# Altium project DI.PrjPcb
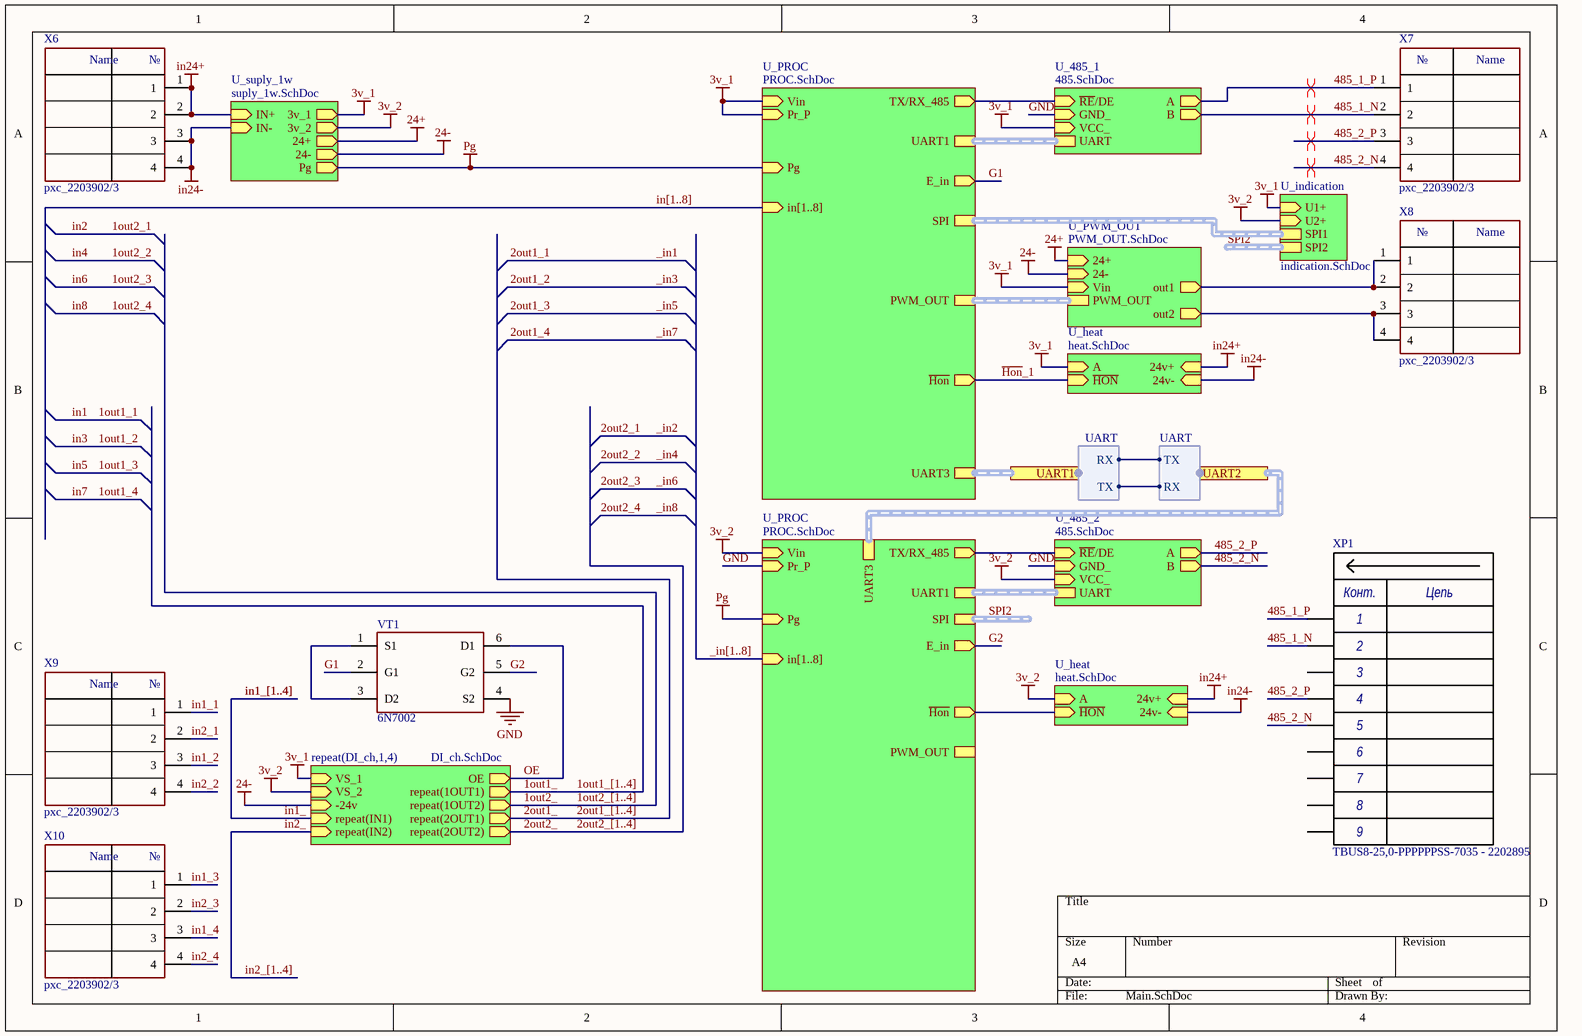
[diagram p0: Main.SchDoc]
8 sheets, 306 parts. Net scope: hierarchical (ports join the sheet entries above them; power ports are global).
Board file: ЕРКФ.758725.093Д11_МОСК.PcbDoc
Sheets:
  Main.SchDoc
    DI_ch1 = DI_ch.SchDoc
    DI_ch2 = DI_ch.SchDoc
    DI_ch3 = DI_ch.SchDoc
    DI_ch4 = DI_ch.SchDoc
    U_suply_1w = suply_1w.SchDoc
    U_485_1 = 485.SchDoc
    U_PROC = PROC.SchDoc
    U_485_2 = 485.SchDoc
    U_PROC = PROC.SchDoc
    U_PWM_OUT = PWM_OUT.SchDoc
    U_indication = indication.SchDoc
    U_heat = heat.SchDoc
    U_heat = heat.SchDoc

## Sheet Main.SchDoc
size A4

### Parts
VT1  6N7002  [sot-23-6]
X6  pxc_2203902/3  [pxc_2203902]
X7  pxc_2203902/3  [pxc_2203902]
X8  pxc_2203902/3  [pxc_2203903]
X9  pxc_2203902/3  [pxc_2203903]
X10  pxc_2203902/3  [pxc_2203903]
XP1  TBUS8-25,0-PPPPPPSS-7035 - 2202895  [TBUS8-25,0-PPPPPPSS-7035 - 2202895]

### Sub-sheets
repeat(DI_ch,1,4) = DI_ch.SchDoc: VS_1 (in), OE (out), -24v (in), repeat(IN1) (in), repeat(IN2) (in), VS_2 (in), repeat(1OUT1) (out), repeat(1OUT2) (out), repeat(2OUT1) (out), repeat(2OUT2) (out)
U_485_1 = 485.SchDoc: ~{RE}/DE (in), GND_ (in), VCC_ (in), A (out), B (out), UART (harness UART)
U_485_2 = 485.SchDoc: ~{RE}/DE (in), GND_ (in), VCC_ (in), A (out), B (out), UART (harness UART)
U_heat = heat.SchDoc: A (in), ~{HON} (in), 24v+ (in), 24v- (in)
U_heat = heat.SchDoc: A (in), ~{HON} (in), 24v+ (in), 24v- (in)
U_indication = indication.SchDoc: U1+ (in), U2+ (in), SPI1 (harness SPI), SPI2 (harness SPI)
U_PROC = PROC.SchDoc: Vin (in), UART1 (harness UART), TX/RX_485 (out), SPI (harness SPI), UART3 (harness UART), PWM_OUT (harness PWM_OUT), Pr_P (in), in[1..8] (in), ~{Hon} (out), Pg (in), E_in (out)
U_PROC = PROC.SchDoc: Vin (in), UART1 (harness UART), TX/RX_485 (out), SPI (harness SPI), UART3 (harness UART), PWM_OUT (harness PWM_OUT), Pr_P (in), in[1..8] (in), ~{Hon} (out), Pg (in), E_in (out)
U_PWM_OUT = PWM_OUT.SchDoc: out2 (out), 24+ (in), 24- (in), out1 (out), Vin (in), PWM_OUT (harness PWM_OUT)
U_suply_1w = suply_1w.SchDoc: IN+ (in), IN- (in), 3v_1 (out), 3v_2 (out), 24+ (out), 24- (out), Pg (out)

### Ports
UART1 (harness UART), UART2 (harness UART)

### Harnesses
UART: RX, TX

### Nets
3v_1: sheet repeat(DI_ch,1,4)/VS_1, sheet U_suply_1w/3v_1, sheet U_485_1/VCC_, sheet U_PROC/Vin, sheet U_PROC/Pr_P, sheet U_PWM_OUT/Vin, sheet U_indication/U1+, sheet U_heat/A
3v_2: sheet repeat(DI_ch,1,4)/VS_2, sheet U_suply_1w/3v_2, sheet U_485_2/VCC_, sheet U_PROC/Vin, sheet U_indication/U2+, sheet U_heat/A
24+: sheet U_suply_1w/24+, sheet U_PWM_OUT/24+
24-: sheet repeat(DI_ch,1,4)/-24v, sheet U_suply_1w/24-, sheet U_PWM_OUT/24-
GND: VT1.4(S2) ; sheet U_485_1/GND_, sheet U_485_2/GND_, sheet U_PROC/Pr_P
in24+: X6.1 X6.2 ; sheet U_suply_1w/IN+, sheet U_heat/24v+, sheet U_heat/24v+
in24-: X6.3 X6.4 ; sheet U_suply_1w/IN-, sheet U_heat/24v-, sheet U_heat/24v-
Pg: sheet U_suply_1w/Pg, sheet U_PROC/Pg, sheet U_PROC/Pg
1out1_: sheet repeat(DI_ch,1,4)/repeat(1OUT1)
1out2_: sheet repeat(DI_ch,1,4)/repeat(1OUT2)
2out1_: sheet repeat(DI_ch,1,4)/repeat(2OUT1)
2out2_: sheet repeat(DI_ch,1,4)/repeat(2OUT2)
485_1_N: X7.2 XP1.2(2c) ; sheet U_485_1/B
485_1_P: X7.1 XP1.1(1c) ; sheet U_485_1/A
485_2_N: X7.4 XP1.5(5c) ; sheet U_485_2/B
485_2_P: X7.3 XP1.4(4c) ; sheet U_485_2/A
G1: VT1.2(G1) ; sheet U_PROC/E_in
G2: VT1.5(G2) ; sheet U_PROC/E_in
~{Hon}_1: sheet U_PROC/~{Hon}, sheet U_heat/~{HON}
in1_: sheet repeat(DI_ch,1,4)/repeat(IN1)
in1_1: X9.1
in1_2: X9.3
in1_3: X10.1
in1_4: X10.3
in2_: sheet repeat(DI_ch,1,4)/repeat(IN2)
in2_1: X9.2
in2_2: X9.4
in2_3: X10.2
in2_4: X10.4
OE: VT1.6(D1) ; sheet repeat(DI_ch,1,4)/OE
NetC43_U_485_1_1: sheet U_485_1/~{RE}/DE, sheet U_PROC/TX/RX_485
NetC43_U_485_2_1: sheet U_485_2/~{RE}/DE, sheet U_PROC/TX/RX_485
NetDD1_U_PROC#1_39: port UART2.RX, port UART1.TX
NetDD1_U_PROC#1_40: port UART2.TX, port UART1.RX
NetDD1_U_PROC#2_14: sheet U_PROC/~{Hon}, sheet U_heat/~{HON}
NetFU2_2: X8.1 X8.2 ; sheet U_PWM_OUT/out1
NetFU3_2: X8.3 X8.4 ; sheet U_PWM_OUT/out2
NetVT1_1: VT1.1(S1) VT1.3(D2)

Not connected (* = marked no-connect by the designer): XP1 3(3c) 6(6c) 7(7e) 8(8e) 9

### Buses and harness runs
bus 1out1_[1..4]
bus 1out2_[1..4]
bus 2out1_[1..4]
bus 2out2_[1..4]
bus _in[1..8] = sheet U_PROC/in[1..8]
bus in1_[1..4]
bus in2_[1..4]
bus in[1..8] = sheet U_PROC/in[1..8]
harness port UART1 = sheet U_PROC/UART3
harness port UART2 = sheet U_PROC/UART3
harness sheet U_485_1/UART = sheet U_PROC/UART1
harness sheet U_485_2/UART = sheet U_PROC/UART1
harness sheet U_indication/SPI1 = sheet U_PROC/SPI
harness sheet U_PROC/PWM_OUT = sheet U_PWM_OUT/PWM_OUT
harness SPI2 = sheet U_indication/SPI2
harness SPI2 = sheet U_PROC/SPI

### Layout directives
differential pair: 485_1_N, 485_1_P, 485_2_N, 485_2_P

### Notes on the sheet
- (in symbol pxc_2203902/3) Name; №
- (in symbol TBUS8-25,0-PPPPPPSS-7035 - 2202895) Конт.; Цепь

### Library data of the parts
XP1 = TBUS8-25,0-PPPPPPSS-7035 - 2202895: Type: TBUS8-25,0-PPPPPPSS-7035 - 2202895

## Sheet DI_ch.SchDoc
size A4
Used 4 times, as channels DI_ch1, DI_ch2, DI_ch3, DI_ch4. Parts and nets are listed once, with the designators drawn on the sheet.
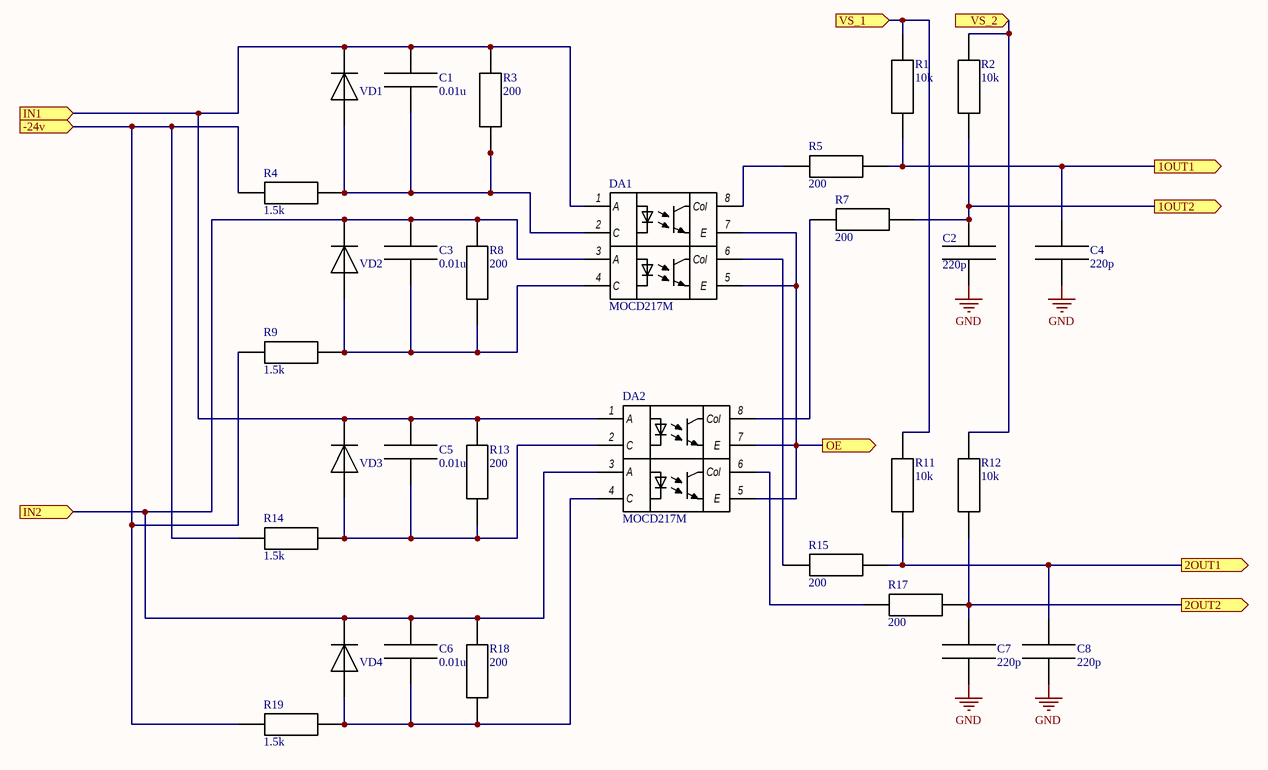
[diagram p1: DI_ch.SchDoc]

### Parts
C1  0.01u  [0603_cap]
C2  220p  [cap_0402]
C3  0.01u  [0603_cap]
C4  220p  [cap_0402]
C5  0.01u  [0603_cap]
C6  0.01u  [0603_cap]
C7  220p  [cap_0402]
C8  220p  [cap_0402]
DA1  MOCD217M  [SO-8_optocup]
DA2  MOCD217M  [SO-8_optocup]
R1  10k  [res_0402]
R2  10k  [res_0402]
R3  200  [0603_res]
R4  1.5k  [2512_res]
R5  200  [res_0402]
R7  200  [res_0402]
R8  200  [0603_res]
R9  1.5k  [2512_res]
R11  10k  [res_0402]
R12  10k  [res_0402]
R13  200  [0603_res]
R14  1.5k  [2512_res]
R15  200  [res_0402]
R17  200  [res_0402]
R18  200  [0603_res]
R19  1.5k  [2512_res]
VD1  1N4448  [sod-323]  (value not drawn)
VD2  1N4448  [sod-323]  (value not drawn)
VD3  1N4448  [sod-323]  (value not drawn)
VD4  1N4448  [sod-323]  (value not drawn)

### Ports
1OUT1 (out), 1OUT2 (out), 2OUT1 (out), 2OUT2 (out), -24v (in), IN1 (in), IN2 (in), OE (out), VS_1 (in), VS_2 (in)

### Nets
GND: C2.1 C4.1 C7.1 C8.1
1OUT1: C4.2 R1.1 R5.1 ; port 1OUT1
1OUT2: C2.2 R2.1 R7.1 ; port 1OUT2
2OUT1: C8.2 R11.1 R15.1 ; port 2OUT1
2OUT2: C7.2 R12.1 R17.1 ; port 2OUT2
-24v: R4.1 R9.1 R14.1 R19.1 ; port -24v
IN1: C1.2 C5.2 DA1.1(A) DA2.1(A) R3.2 R13.2 VD1.K VD3.K ; port IN1
IN2: C3.2 C6.2 DA1.3(A) DA2.3(A) R8.2 R18.2 VD2.K VD4.K ; port IN2
OE: DA1.5(E) DA1.7(E) DA2.5(E) DA2.7(E) ; port OE
VS_1: R1.2 R11.2 ; port VS_1
VS_2: R2.2 R12.2 ; port VS_2
NetC1_1: C1.1 DA1.2(C) R3.1 R4.2 VD1.A
NetC3_1: C3.1 DA1.4(C) R8.1 R9.2 VD2.A
NetC5_1: C5.1 DA2.2(C) R13.1 R14.2 VD3.A
NetC6_1: C6.1 DA2.4(C) R18.1 R19.2 VD4.A
NetDA1_6: DA1.6(Col) R15.2
NetDA1_8: DA1.8(Col) R5.2
NetDA2_6: DA2.6(Col) R17.2
NetDA2_8: DA2.8(Col) R7.2

### Channels
DI_ch1: designators end in _DI_ch1; ports 1OUT1=1out1_1 1OUT2=1out2_1 2OUT1=2out1_1 2OUT2=2out2_1 -24v=24- IN1=in1_1 IN2=in2_1 OE=OE VS_1=3v_1 VS_2=3v_2
DI_ch2: designators end in _DI_ch2; ports 1OUT1=1out1_2 1OUT2=1out2_2 2OUT1=2out1_2 2OUT2=2out2_2 -24v=24- IN1=in1_2 IN2=in2_2 OE=OE VS_1=3v_1 VS_2=3v_2
DI_ch3: designators end in _DI_ch3; ports 1OUT1=1out1_3 1OUT2=1out2_3 2OUT1=2out1_3 2OUT2=2out2_3 -24v=24- IN1=in1_3 IN2=in2_3 OE=OE VS_1=3v_1 VS_2=3v_2
DI_ch4: designators end in _DI_ch4; ports 1OUT1=1out1_4 1OUT2=1out2_4 2OUT1=2out1_4 2OUT2=2out2_4 -24v=24- IN1=in1_4 IN2=in2_4 OE=OE VS_1=3v_1 VS_2=3v_2

### Library data of the parts
C1-C8 = cap
DA1 DA2 = MOCD217M: dual optopair
R1-R5 R7-R9 R11-R15 R17-R19 = res

## Sheet suply_1w.SchDoc
size A4
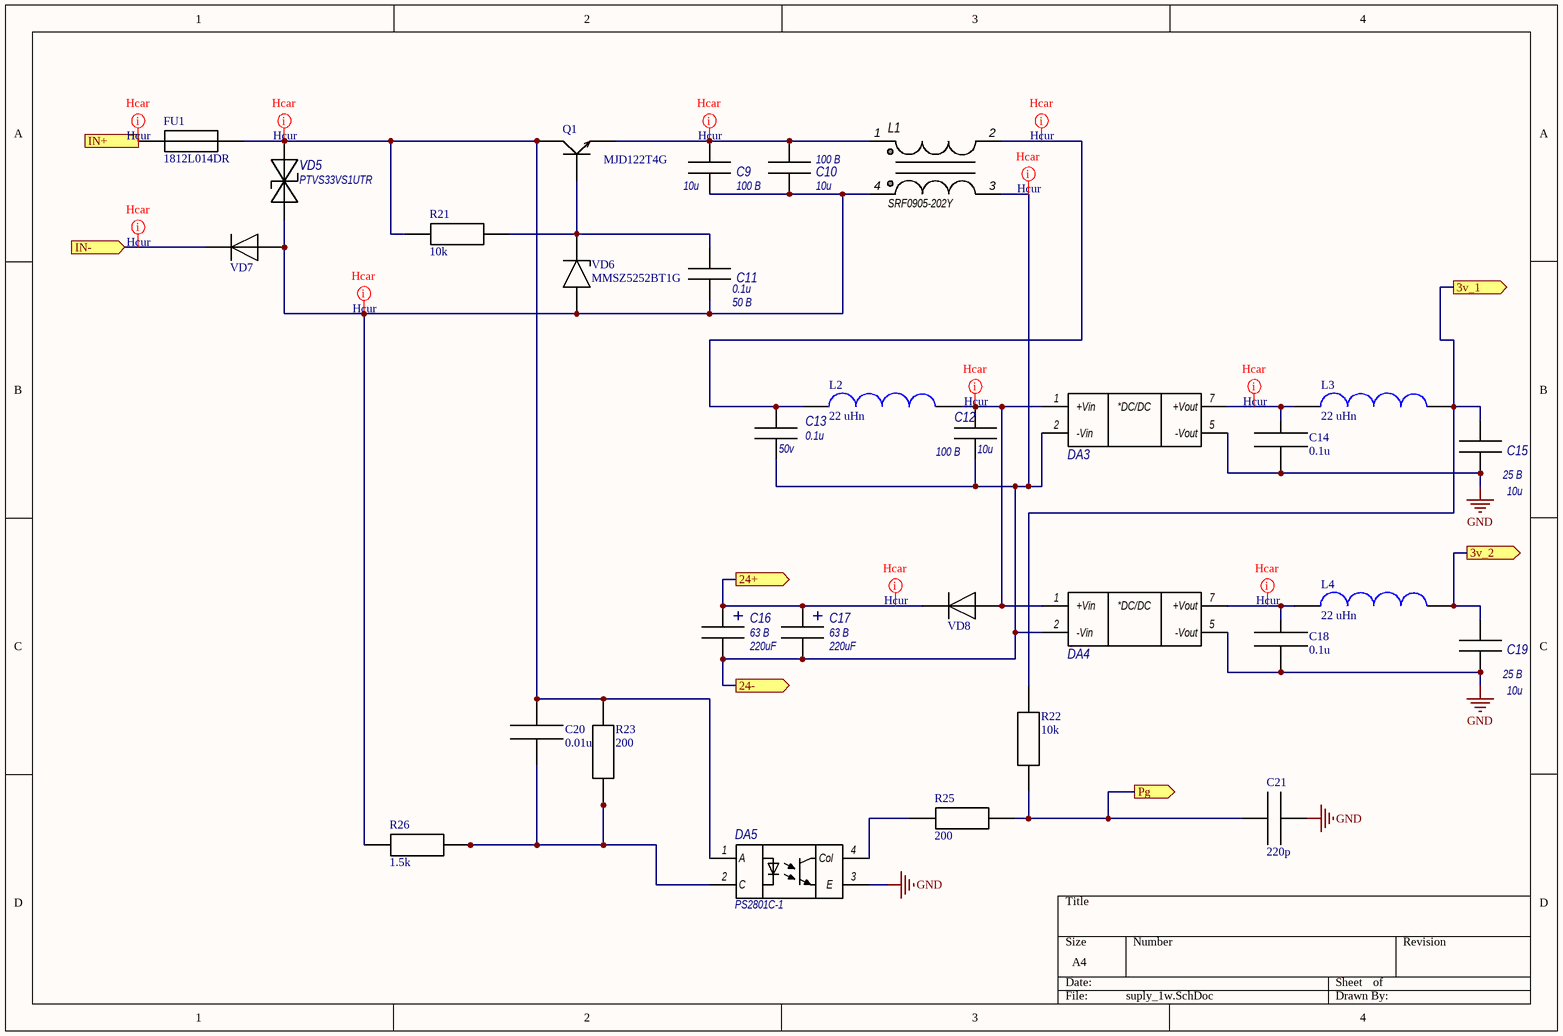
[diagram p2: suply_1w.SchDoc]

### Parts
C9  value 10u  Voltage: 100 В  [C1206_]  (hidden comment: 10u 100v)
C10  value 10u  Voltage: 100 В  [C1206_]  (hidden comment: 10u 100v)
C11  Voltage: 50 В  [C0603]  (hidden comment: 0.1u)
C12  value 10u  Voltage: 100 В  [C1206_]  (hidden comment: 10u 100v)
C13  Voltage: 50v  [C0603]  (hidden comment: 0.1u)
C14  0.1u  [cap_0402]
C15  Voltage: 25 В  [C0603]  (hidden comment: 10u)
C16  value 220uF  Voltage: 63 В  [rad_cap_10х12]  (hidden comment: 220u 63v)
C17  value 220uF  Voltage: 63 В  [rad_cap_10х12]  (hidden comment: 220u 63v)
C18  0.1u  [cap_0402]
C19  Voltage: 25 В  [C0603]  (hidden comment: 10u)
C20  0.01u  [0603_cap]
C21  220p  [cap_0402]
DA3  AM1D-2403SH30Z  [AM1D-2405]  (value not drawn)
DA4  AM1D-2403SH30Z  [AM1D-2405]  (value not drawn)
DA5  PS2801C-1  [SSOP-4N]
FU1  1812L014DR  [fuse1210]
L1  value SRF0905-202Y  [SRF0905]  (hidden comment: SRF0905)
L2  22 uHn  [ifsc1515]
L3  22 uHn  [ifsc1515]
L4  22 uHn  [ifsc1515]
Q1  MJD122T4G  [sot23]
R21  10k  [0603_res]
R22  10k  [res_0402]
R23  200  [0603_res]
R25  200  [res_0402]
R26  1.5k  [2512_res]
VD5  PTVS33VS1UTR  [SOD-123]
VD6  MMSZ5252BT1G  [SOD-123]
VD7  1N4448W  [SOD-123]  (value not drawn)
VD8  1N4448W  [SOD-123]  (value not drawn)

### Ports
3v_1 (out), 3v_2 (out), 24+ (out), 24- (out), IN+ (in), IN- (in), Pg (out)

### Nets
3v_1: C15.2 L3.2 R22.2 ; port 3v_1
3v_2: C19.2 L4.2 ; port 3v_2
24+: C16.1(A) C17.1(A) VD8.K ; port 24+
24-: C12.1 C13.1 C16.2(K) C17.2(K) DA3.2(-Vin) DA4.2(-Vin) L1.3 ; port 24-
GND: C14.2 C15.1 C18.2 C19.1 C21.1 DA3.5(-Vout) DA4.5(-Vout) DA5.3(E)
in24+: FU1.1 ; port IN+
in24-: VD7.K ; port IN-
Pg: C21.2 R22.1 R25.1 ; port Pg
NetC9_1: C9.1 C10.1 C11.1 L1.4 R26.1 VD5.A VD6.A VD7.A
NetC9_2: C9.2 C10.2 L1.1 Q1.3(E)
NetC11_2: C11.2 Q1.1(B) R21.2 VD6.K
NetC12_2: C12.2 DA3.1(+Vin) DA4.1(+Vin) L2.2 VD8.A
NetC13_2: C13.2 L1.2 L2.1
NetC14_1: C14.1 DA3.7(+Vout) L3.1
NetC18_1: C18.1 DA4.7(+Vout) L4.1
NetC20_1: C20.1 DA5.2(C) R23.1 R26.2
NetC20_2: C20.2 DA5.1(A) FU1.2 Q1.2(K) R21.1 R23.2 VD5.K
NetDA5_4: DA5.4(Col) R25.2

### Layout directives
net class Hcur: 24+, 24-, in24+, in24-, NetC9_1, NetC9_2, NetC12_2, NetC13_2, NetC14_1, NetC18_1, NetC20_2

### Notes on the sheet
- (in symbol AM1D-2405SH30Z) *DC/DC
- (in symbol Capacitor electrolytic) +

### Library data of the parts
C9 C10 C12 = Capacitor ceramic: Capacitance: 10u x 100 В; Dielectric: *; Tolerance: *
C11 = Capacitor ceramic: Capacitance: 0.1u x 50 В; Dielectric: *; Tolerance: *; Value: 0.1u
C13 = Capacitor ceramic: Capacitance: 0.1u x 50v; Dielectric: *; Tolerance: *; Value: 0.1u
C14 C18 C20 C21 = cap
C15 C19 = Capacitor ceramic: Capacitance: 10u x 25 В; Dielectric: *; Tolerance: *; Value: 10u
C16 = Capacitor electrolytic: Tolerance: ±20%; Polarization: Polar; Capacitance: 220uF x 63 В; Famile: Capacitor; Category: Capacitors; Operating Temperature: -40°C ~ 105°C; Package / Case: Radial, Can - SMD; ComponentLink1Description: Параметры; ComponentLink1URL: 5\res\Справочники\Конденсаторы\KEM_A4003_EXV.pdf; Dielectric: 63v
C17 = Capacitor electrolytic: 10x12; Tolerance: ±20%; Polarization: Polar; Capacitance: 220uF x 63 В; Famile: Capacitor; Category: Capacitors; Operating Temperature: -40°C ~ 105°C; Package / Case: Radial, Can - SMD; ComponentLink1Description: Параметры; ComponentLink1URL: 5\res\Справочники\Конденсаторы\KEM_A4003_EXV.pdf; Dielectric: 63v
DA3 DA4 = AM1D-2405SH30Z: AM1D-2403SH30Z 21.6-26.4V 3.3V 200mA 3000V 54мА 6мА 220мкF 77%
FU1 = fuse
L2-L4 = ind_b82477g4
Q1 = npn
R21-R23 R25 R26 = res
VD5 = PTVS33VS1UTR: PTVS33VS1UTR,115, TVS DIODE 33VWM 53.3VC SOD123W; Type: PTVS33VS1UTR
VD6 = stab: MMSZ5252BT1G, Стабилитрон 0.5Вт 24В
VD7 VD8 = 1N4448
DA5 = PS2801C-1: Type: PS2801C-1

## Sheet 485.SchDoc
size 420 x 297 mm; PageSetup: Record=PageOptions|CenterHorizontal=True|CenterVertical=True|PrintScale=0.94|XCorrection=1.00|YCorrection=1.00|PrintKind=1|BorderSize=5000000|LeftOffset=0|BottomOffset=0|Orientation=1|PaperLength=1000|PaperWidth=1000|Scale=100|PaperSource=7|PrintQuality=-4|MediaType=1|DitherType=10|PaperKind=A4|PrintScaleMode=1; DecimalNumber: Децимальный номер; HeadOfSector: Нач. сектора; MainDevice: Перв.примен.; Name: Наименование
Used 2 times, as channels U_485_1, U_485_2. Parts and nets are listed once, with the designators drawn on the sheet.
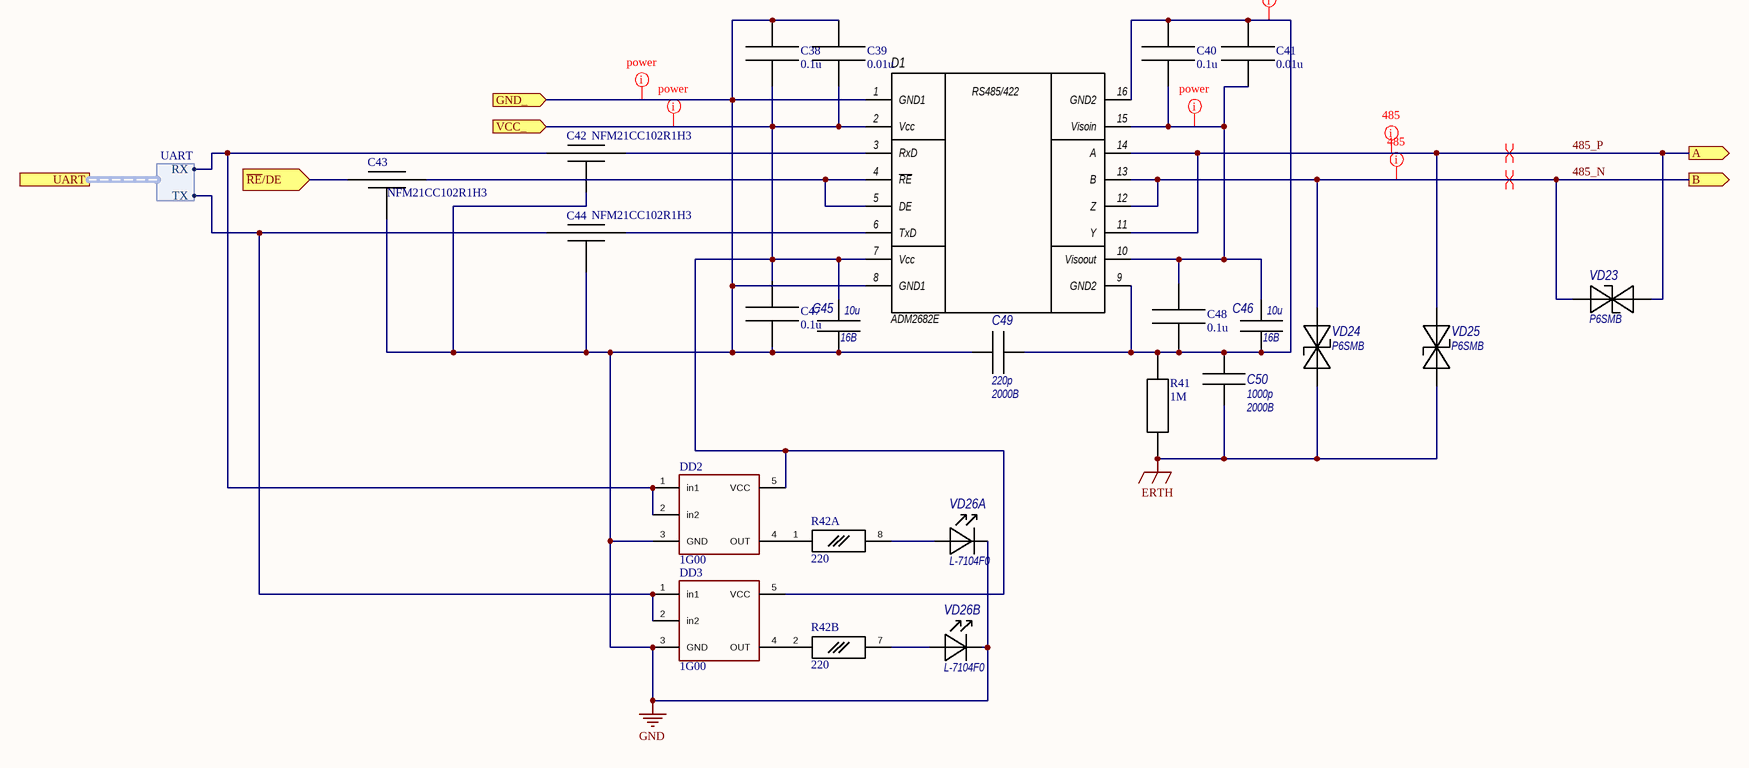
[diagram p3: 485.SchDoc]

### Parts
C38  0.1u  [cap_0402]
C39  0.01u  [cap_0402]
C40  0.1u  [cap_0402]
C41  0.01u  [cap_0402]
C42  NFM21CC102R1H3  [NFM21C]
C43  NFM21CC102R1H3  [NFM21C]
C44  NFM21CC102R1H3  [NFM21C]
C45  value 10u  Voltage: 16В  [C0805_]  (hidden comment: 10u 16v)
C46  value 10u  Voltage: 16В  [C0805_]  (hidden comment: 10u 16v)
C47  0.1u  [cap_0402]
C48  0.1u  [cap_0402]
C49  value 220p  Voltage: 2000В  [C1206_]  (hidden comment: 220p 2000v)
C50  value 1000p  Voltage: 2000В  [C1206_]  (hidden comment: 1000p 2000v)
D1  Type: ADM2682E  [SOIC_16IC_]  (hidden comment: ADM2682E_RS485_422_Isol)
DD2  1G00  [sot-23-5]
DD3  1G00  [sot-23-5]
R41  1M  [0805-res]
R42  220  [YC164]  (parts A,B of 4)
VD23  Type: P6SMB  [SOD-123]  (hidden comment: PTVS33VS1UTR)
VD24  Type: P6SMB  [SOD-123]  (hidden comment: PTVS33VS1UTR)
VD25  Type: P6SMB  [SOD-123]  (hidden comment: PTVS33VS1UTR)
VD26  Type: L-7104F0  [L-7104_]  (hidden comment: Diod_sv_L-7104F0)  (parts A,B of 2)

### Ports
A (out), B (out), GND_ (in), UART (harness UART), VCC_ (in), ~{RE}/DE (in)

### Harnesses
UART: RX, TX

### Nets
ERTH: C50.1 R41.1 VD24.A VD25.A
GND: C38.2 C39.1 C42.3(Gnd) C43.3(Gnd) C44.3(Gnd) C45.1 C47.1 C49.1 D1.1(GND1) D1.8(GND1) DD2.3(GND) DD3.3(GND) VD26.2(K1) VD26.4(K2) ; port GND_
485_N: D1.12(Z) D1.13(B) VD23.K VD24.K ; port B
485_P: D1.11(Y) D1.14(A) VD23.A VD25.K ; port A
~{RE}/DE: C43.1(in) ; port ~{RE}/DE
VCC_: C38.1 C39.2 C45.2 C47.2 D1.2(Vcc) D1.7(Vcc) DD2.5(VCC) DD3.5(VCC) ; port VCC_
NetC40_1: C40.1 C41.2 C46.2 C48.2 D1.10(Visoout) D1.15(Visoin)
NetC40_2: C40.2 C41.1 C46.1 C48.1 C49.2 C50.2 D1.9(GND2) D1.16(GND2) R41.2
NetC42_1: C42.1(in) DD2.1(in1) DD2.2(in2) ; port UART.RX
NetC42_2: C42.2(out) D1.3(RxD)
NetC43_2: C43.2(out) D1.4(~{RE}) D1.5(DE)
NetC44_1: C44.1(in) DD3.1(in1) DD3.2(in2) ; port UART.TX
NetC44_2: C44.2(out) D1.6(TxD)
NetDD2_4: DD2.4(OUT) R42.1
NetDD3_4: DD3.4(OUT) R42.2
NetR42_7: R42.7 VD26.3(A2)
NetR42_8: R42.8 VD26.1(A1)

### Channels
U_485_1: designators end in _U_485_1; ports A=485_1_P B=485_1_N GND_=GND VCC_=3v_1 ~{RE}/DE=NetC43_U_485_1_1
U_485_2: designators end in _U_485_2; ports A=485_2_P B=485_2_N GND_=GND VCC_=3v_2 ~{RE}/DE=NetC43_U_485_2_1

### Layout directives
net class power: GND, NetC40_U_485_1_1, NetC40_U_485_1_2
rule Width Constraint [Pref Width = 0.3mm    Min Width = 0.3mm    Max Width = 5mm]; net class power: 3v_1
net class 485: 485_1_N, 485_1_P
differential pair: 485_1_N, 485_1_P

### Notes on the sheet
- Подп. и дата
- Инв.№ дубл.
- Взам.инв.№
- Подп.и дата
- Инв.№ подл.
- Изм.
- Лист
- № докум.
- Подп.
- Дата
- Формат  A3
- (in symbol ADM2682E_RS485_422_Isol) RS485/422

### Library data of the parts
C38-C41 C47 C48 = cap
C42-C44 = NFM21C
C45 C46 = Capacitor ceramic: Capacitance: 10u x 16В; Dielectric: *; Tolerance: *
C49 = Capacitor ceramic: Capacitance: 220p x 2000В; Dielectric: *; Tolerance: *
C50 = Capacitor ceramic: Capacitance: 1000p x 2000В; Dielectric: *; Tolerance: *
DD2 DD3 = 1G00: 2NAND
R41 = res
R42 = res_array: YC164
VD23-VD25 = PTVS33VS1UTR: as VD5 on sheet suply_1w

## Sheet PROC.SchDoc
size A4
Used 2 times, as channels U_PROC, U_PROC. Parts and nets are listed once, with the designators drawn on the sheet.
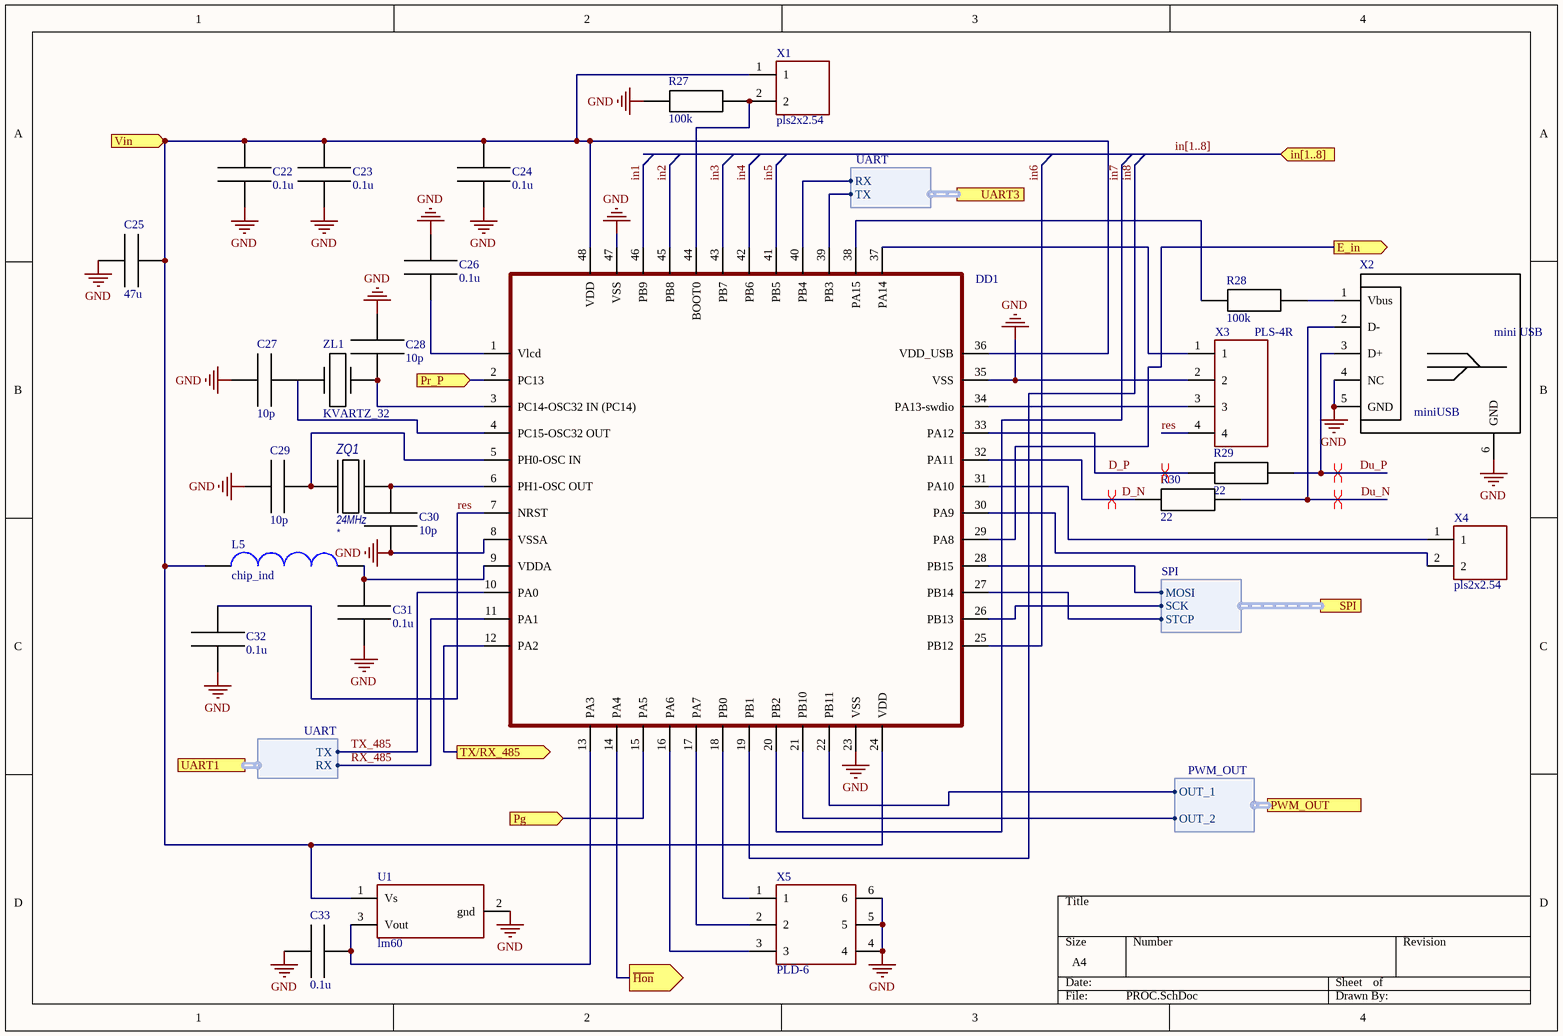
[diagram p4: PROC.SchDoc]

### Parts
C22  0.1u  [cap_0402]
C23  0.1u  [cap_0402]
C24  0.1u  [cap_0402]
C25  47u  [1206-cap]
C26  0.1u  [cap_0402]
C27  10p  [cap_0402]
C28  10p  [cap_0402]
C29  10p  [cap_0402]
C30  10p  [cap_0402]
C31  0.1u  [cap_0402]
C32  0.1u  [cap_0402]
C33  0.1u  [cap_0402]
DD1  STM32L073CBT6  [LQFP48]  (value not drawn)
L5  chip_ind  [0603_ind]
R27  100k  [res_0402]
R28  100k  [res_0402]
R29  22  [res_0402]
R30  22  [res_0402]
U1  lm60  [sot23]
X1  pls2x2.54  [pls2x2.54]
X2  miniUSB  [miniUSB]
X3  PLS-4R  [pls-4r]
X4  pls2x2.54  [pls2x2.54]
X5  PLD-6  [PLD6]
ZL1  KVARTZ_32  [zm206]
ZQ1  Type: 24MHz  [ECX-53B-DU]  (hidden comment: ESX-53-DU)

### Ports
E_in (out), in[1..8] (in), Pg (in), Pr_P (in), PWM_OUT (harness PWM_OUT), SPI (harness SPI), TX/RX_485 (out), UART1 (harness UART), UART3 (harness UART), Vin (in), ~{Hon} (out)

### Harnesses
UART: RX, TX
SPI: MOSI, SCK, STCP
PWM_OUT: OUT_1, OUT_2

### Nets
GND: C22.2 C23.2 C24.2 C25.1 C26.2 C27.2 C28.2 C29.2 C30.1 C31.2 C32.2 C33.1 DD1.8(VSSA) DD1.23(VSS) DD1.35(VSS) DD1.47(VSS) R27.1 U1.2(gnd) X2.4(NC) X2.5(GND) X2.6(GND) X3.2 X5.4 X5.5 X5.6 ZQ1.2 ZQ1.4
D_N: DD1.32(PA11) R30.1
D_P: DD1.33(PA12) R29.1
Du_N: R30.2 X2.2(D-)
Du_P: R29.2 X2.3(D+)
E_in: DD1.29(PA8) ; port E_in
~{Hon}: DD1.14(PA4) ; port ~{Hon}
in1: DD1.46(PB9)
in2: DD1.45(PB8)
in3: DD1.43(PB7)
in4: DD1.42(PB6)
in5: DD1.41(PB5)
in6: DD1.25(PB12)
in7: DD1.20(PB2)
in8: DD1.19(PB1)
Pg: DD1.15(PA5) ; port Pg
Pr_P: DD1.2(PC13) ; port Pr_P
res: C32.1 DD1.7(NRST) X3.4
RX_485: DD1.11(PA1) ; port UART1.RX
TX/RX_485: DD1.12(PA2) ; port TX/RX_485
TX_485: DD1.10(PA0) ; port UART1.TX
Vin: C22.1 C23.1 C24.1 C25.2 DD1.24(VDD) DD1.36(VDD_USB) DD1.48(VDD) L5.1 U1.1(Vs) X1.1 ; port Vin
NetC26_1: C26.1 DD1.1(Vlcd)
NetC27_1: C27.1 DD1.4(PC15-OSC32_OUT) ZL1.2
NetC28_1: C28.1 DD1.3(PC14-OSC32_IN_(PC14)) ZL1.1
NetC29_1: C29.1 DD1.5(PH0-OSC_IN) ZQ1.1
NetC30_2: C30.2 DD1.6(PH1-OSC_OUT) ZQ1.3
NetC31_1: C31.1 DD1.9(VDDA) L5.2
NetC33_2: C33.2 DD1.13(PA3) U1.3(Vout)
NetDD1_16: DD1.16(PA6) X5.3
NetDD1_17: DD1.17(PA7) X5.2
NetDD1_18: DD1.18(PB0) X5.1
NetDD1_21: DD1.21(PB10) ; port PWM_OUT.OUT_2
NetDD1_22: DD1.22(PB11) ; port PWM_OUT.OUT_1
NetDD1_26: DD1.26(PB13) ; port SPI.SCK
NetDD1_27: DD1.27(PB14) ; port SPI.STCP
NetDD1_28: DD1.28(PB15) ; port SPI.MOSI
NetDD1_30: DD1.30(PA9) X4.2
NetDD1_31: DD1.31(PA10) X4.1
NetDD1_34: DD1.34(PA13-swdio) X3.3
NetDD1_37: DD1.37(PA14) X3.1
NetDD1_38: DD1.38(PA15) R28.1
NetDD1_39: DD1.39(PB3) ; port UART3.TX
NetDD1_40: DD1.40(PB4) ; port UART3.RX
NetDD1_44: DD1.44(BOOT0) R27.2 X1.2
NetR28_2: R28.2 X2.1(Vbus)

### Channels
U_PROC: designators end in _U_PROC#1; ports E_in=G1 Pg=Pg Pr_P=3v_1 TX/RX_485=NetC43_U_485_1_1 Vin=3v_1 ~{Hon}=~{Hon}_1
U_PROC: designators end in _U_PROC#2; ports E_in=G2 Pg=Pg Pr_P=GND TX/RX_485=NetC43_U_485_2_1 Vin=3v_2 ~{Hon}=NetDD1_U_PROC#2_14

### Buses and harness runs
bus in[1..8] = port in[1..8]

### Layout directives
differential pair: D_N_U_PROC, D_P_U_PROC, Du_N_U_PROC, Du_P_U_PROC

### Notes on the sheet
- (in symbol miniUSB) mini USB

### Library data of the parts
C22-C33 = cap
L5 = ind
R27-R30 = res
ZQ1 = REZONATOR: Crystal; Value: *

## Sheet PWM_OUT.SchDoc
size A4
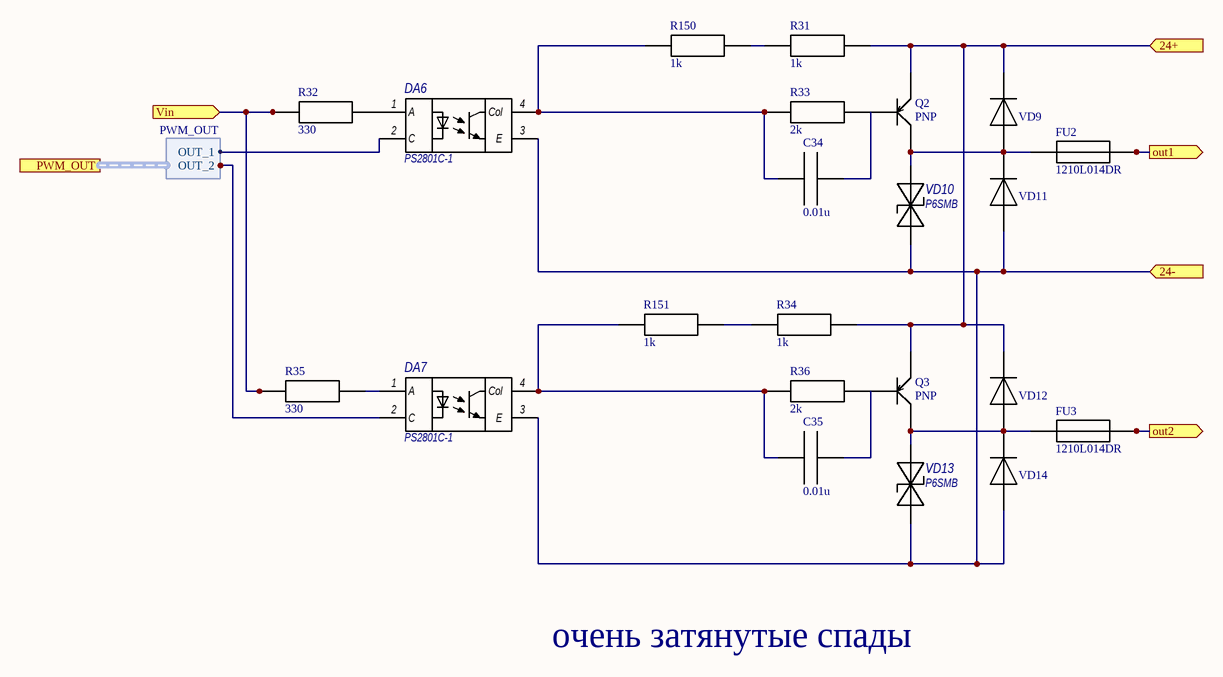
[diagram p5: PWM_OUT.SchDoc]

### Parts
C34  0.01u  [cap_0402]
C35  0.01u  [cap_0402]
DA6  PS2801C-1  [SSOP-4N]
DA7  PS2801C-1  [SSOP-4N]
FU2  1210L014DR  [fuse1210]
FU3  1210L014DR  [fuse1210]
Q2  PNP  [sot23]
Q3  PNP  [sot23]
R31  1k  [0805-res]
R32  330  [res_0402]
R33  2k  [res_0402]
R34  1k  [0805-res]
R35  330  [res_0402]
R36  2k  [res_0402]
R150  1k  [0805-res]
R151  1k  [0805-res]
VD9  1N4448  [sod-323]  (value not drawn)
VD10  Type: P6SMB  [SOD-123]  (hidden comment: PTVS33VS1UTR)
VD11  1N4448  [sod-323]  (value not drawn)
VD12  1N4448  [sod-323]  (value not drawn)
VD13  Type: P6SMB  [SOD-123]  (hidden comment: PTVS33VS1UTR)
VD14  1N4448  [sod-323]  (value not drawn)

### Ports
24+ (in), 24- (in), out1 (out), out2 (out), PWM_OUT (harness PWM_OUT), Vin (in)

### Harnesses
PWM_OUT: OUT_1, OUT_2

### Nets
3v_1: R32.1 R35.1 ; port Vin
24+: Q2.3(K) Q3.3(K) R31.2 R34.2 VD9.K VD12.K ; port 24+
24-: DA6.3(E) DA7.3(E) VD10.A VD11.A VD13.A VD14.A ; port 24-
NetC34_1: C34.1 DA6.4(Col) R33.1 R150.1
NetC34_2: C34.2 Q2.1(B) R33.2
NetC35_1: C35.1 DA7.4(Col) R36.1 R151.1
NetC35_2: C35.2 Q3.1(B) R36.2
NetDA6_1: DA6.1(A) R32.2
NetDA6_2: DA6.2(C) ; port PWM_OUT.OUT_1
NetDA7_1: DA7.1(A) R35.2
NetDA7_2: DA7.2(C) ; port PWM_OUT.OUT_2
NetFU2_1: FU2.1 Q2.2(E) VD9.A VD10.K VD11.K
NetFU2_2: FU2.2 ; port out1
NetFU3_1: FU3.1 Q3.2(E) VD12.A VD13.K VD14.K
NetFU3_2: FU3.2 ; port out2
NetR31_1: R31.1 R150.2
NetR34_1: R34.1 R151.2

### Notes on the sheet
- очень затянутые спады

### Library data of the parts
C34 C35 = cap
FU2 FU3 = fuse
R31-R36 R150 R151 = res
VD10 VD13 = PTVS33VS1UTR: as VD5 on sheet suply_1w
DA6 DA7 = PS2801C-1: Type: PS2801C-1

## Sheet indication.SchDoc
size A4
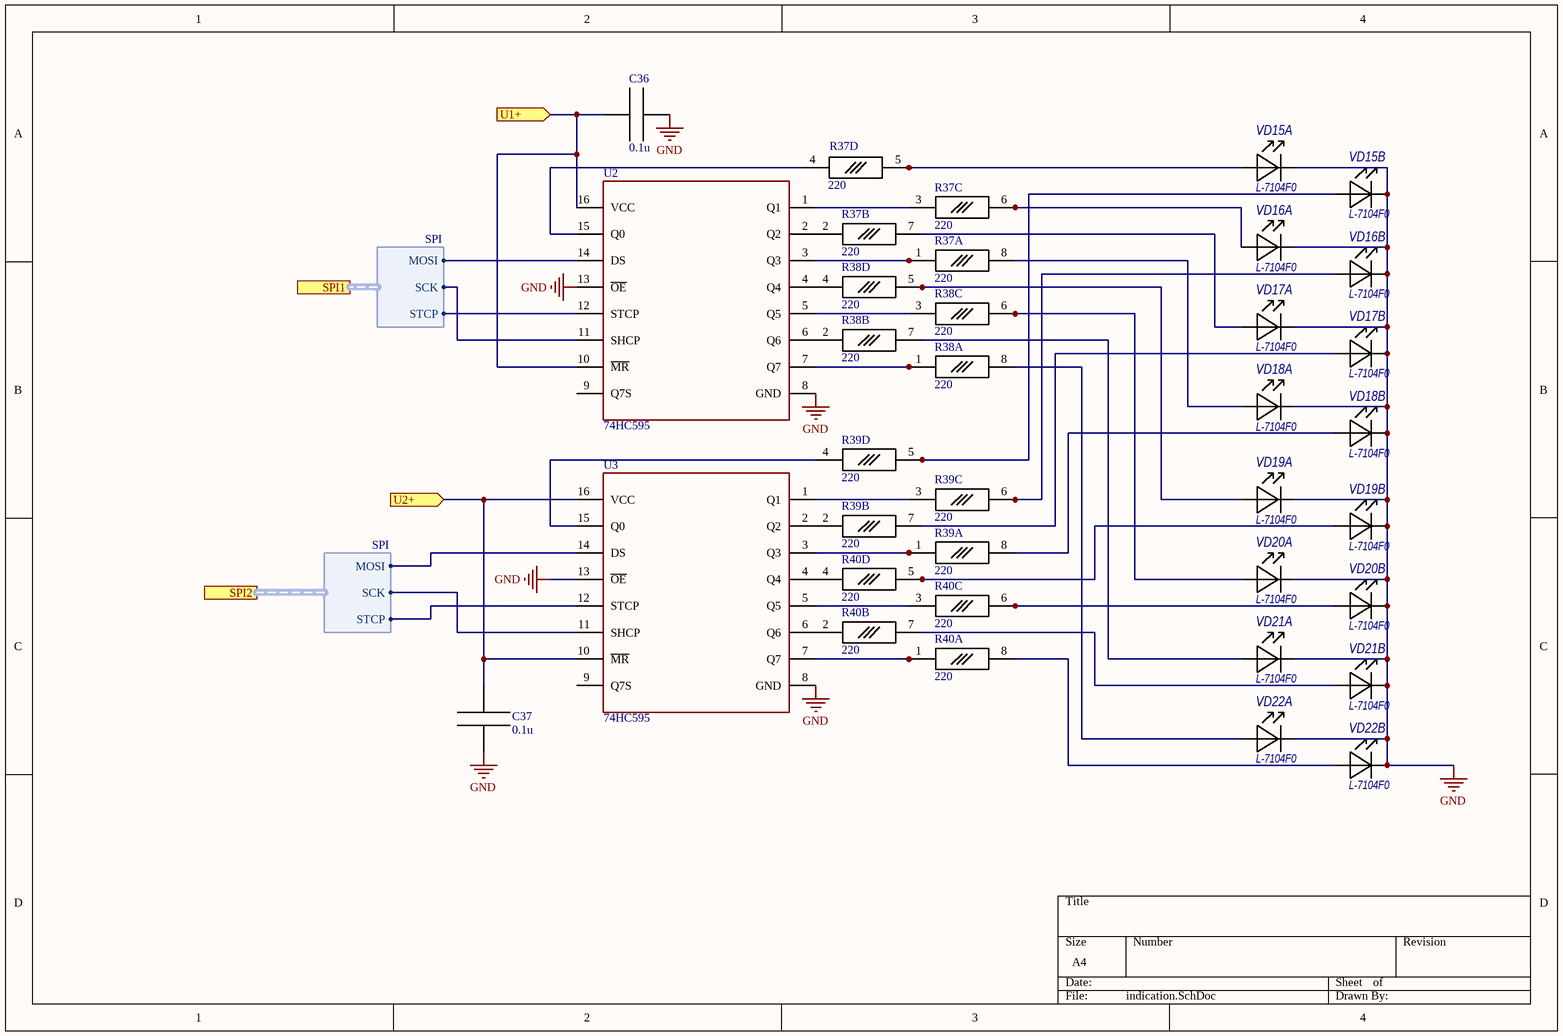
[diagram p6: indication.SchDoc]

### Parts
C36  0.1u  [cap_0402]
C37  0.1u  [cap_0402]
R37  220  [YC164]  (parts A,B,C,D of 4)
R38  220  [YC164]  (parts A,B,C,D of 4)
R39  220  [YC164]  (parts A,B,C,D of 4)
R40  220  [YC164]  (parts A,B,C,D of 4)
U2  74HC595  [TSSOP16]
U3  74HC595  [TSSOP16]
VD15  Type: L-7104F0  [L-7104_]  (hidden comment: Diod_sv_L-7104F0)  (parts A,B of 2)
VD16  Type: L-7104F0  [L-7104_]  (hidden comment: Diod_sv_L-7104F0)  (parts A,B of 2)
VD17  Type: L-7104F0  [L-7104_]  (hidden comment: Diod_sv_L-7104F0)  (parts A,B of 2)
VD18  Type: L-7104F0  [L-7104_]  (hidden comment: Diod_sv_L-7104F0)  (parts A,B of 2)
VD19  Type: L-7104F0  [L-7104_]  (hidden comment: Diod_sv_L-7104F0)  (parts A,B of 2)
VD20  Type: L-7104F0  [L-7104_]  (hidden comment: Diod_sv_L-7104F0)  (parts A,B of 2)
VD21  Type: L-7104F0  [L-7104_]  (hidden comment: Diod_sv_L-7104F0)  (parts A,B of 2)
VD22  Type: L-7104F0  [L-7104_]  (hidden comment: Diod_sv_L-7104F0)  (parts A,B of 2)

### Ports
SPI1 (harness SPI), SPI2 (harness SPI), U1+ (in), U2+ (in)

### Harnesses
SPI: MOSI, SCK, STCP

### Nets
3v_1: C36.1 U2.10(~{MR}) U2.16(VCC) ; port U1+
3v_2: C37.1 U3.10(~{MR}) U3.16(VCC) ; port U2+
GND: C36.2 C37.2 U2.8(GND) U2.13(~{OE}) U3.8(GND) U3.13(~{OE}) VD15.2(K1) VD15.4(K2) VD16.2(K1) VD16.4(K2) VD17.2(K1) VD17.4(K2) VD18.2(K1) VD18.4(K2) VD19.2(K1) VD19.4(K2) VD20.2(K1) VD20.4(K2) VD21.2(K1) VD21.4(K2) VD22.2(K1) VD22.4(K2)
SPI2.MOSI: U3.14(DS) ; port SPI2.MOSI
SPI2.SCK: U3.11(SHCP) ; port SPI2.SCK
SPI2.STCP: U3.12(STCP) ; port SPI2.STCP
NetDD1_U_PROC#1_26: U2.11(SHCP) ; port SPI1.SCK
NetDD1_U_PROC#1_27: U2.12(STCP) ; port SPI1.STCP
NetDD1_U_PROC#1_28: U2.14(DS) ; port SPI1.MOSI
NetR37_1: R37.1 U2.3(Q3)
NetR37_2: R37.2 U2.2(Q2)
NetR37_3: R37.3 U2.1(Q1)
NetR37_4: R37.4 U2.15(Q0)
NetR37_5: R37.5 VD15.1(A1)
NetR37_6: R37.6 VD16.1(A1)
NetR37_7: R37.7 VD17.1(A1)
NetR37_8: R37.8 VD18.1(A1)
NetR38_1: R38.1 U2.7(Q7)
NetR38_2: R38.2 U2.6(Q6)
NetR38_3: R38.3 U2.5(Q5)
NetR38_4: R38.4 U2.4(Q4)
NetR38_5: R38.5 VD19.1(A1)
NetR38_6: R38.6 VD20.1(A1)
NetR38_7: R38.7 VD21.1(A1)
NetR38_8: R38.8 VD22.1(A1)
NetR39_1: R39.1 U3.3(Q3)
NetR39_2: R39.2 U3.2(Q2)
NetR39_3: R39.3 U3.1(Q1)
NetR39_4: R39.4 U3.15(Q0)
NetR39_5: R39.5 VD15.3(A2)
NetR39_6: R39.6 VD16.3(A2)
NetR39_7: R39.7 VD17.3(A2)
NetR39_8: R39.8 VD18.3(A2)
NetR40_1: R40.1 U3.7(Q7)
NetR40_2: R40.2 U3.6(Q6)
NetR40_3: R40.3 U3.5(Q5)
NetR40_4: R40.4 U3.4(Q4)
NetR40_5: R40.5 VD19.3(A2)
NetR40_6: R40.6 VD20.3(A2)
NetR40_7: R40.7 VD21.3(A2)
NetR40_8: R40.8 VD22.3(A2)

Not connected (* = marked no-connect by the designer): U2 9(Q7S); U3 9(Q7S)

### Library data of the parts
C36 C37 = cap
R37-R40 = res_array: YC164

## Sheet heat.SchDoc
size A4
Used 2 times, as channels U_heat, U_heat. Parts and nets are listed once, with the designators drawn on the sheet.
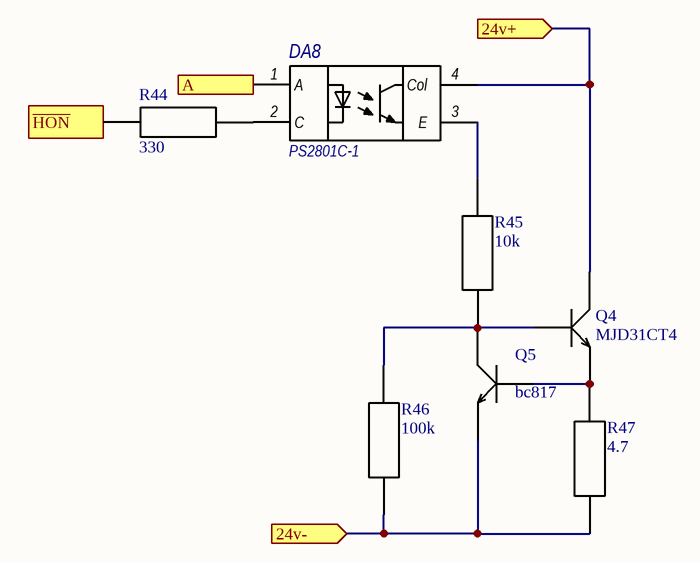
[diagram p7: heat.SchDoc]

### Parts
DA8  PS2801C-1  [SSOP-4N]
Q4  MJD31CT4  [d-pak]
Q5  bc817  [sot23]
R44  330  [res_0402]
R45  10k  [0805-res]
R46  100k  [0805-res]
R47  4.7  [2512_res]

### Ports
24v+ (in), 24v- (in), A (in), ~{HON} (in)

### Nets
24v+: DA8.4(Col) Q4.2(K) ; port 24v+
24v-: Q5.3(E) R46.1 R47.1 ; port 24v-
A: DA8.1(A) ; port A
~{HON}: R44.1 ; port ~{HON}
NetDA8_2: DA8.2(C) R44.2
NetDA8_3: DA8.3(E) R45.2
NetQ4_1: Q4.1(B) Q5.2(K) R45.1 R46.2
NetQ4_3: Q4.3(E) Q5.1(B) R47.2

### Channels
U_heat: designators end in _U_heat#1; ports 24v+=in24+ 24v-=in24- A=3v_1 ~{HON}=~{Hon}_1
U_heat: designators end in _U_heat#2; ports 24v+=in24+ 24v-=in24- A=3v_2 ~{HON}=NetDD1_U_PROC#2_14

### Library data of the parts
Q4 = npn: bc817
Q5 = npn
R44-R47 = res
DA8 = PS2801C-1: Type: PS2801C-1

## Nets that join several sheets
3v_1: DI_ch1 (R1_DI_ch1.2 R11_DI_ch1.2), DI_ch2 (R1_DI_ch2.2 R11_DI_ch2.2), DI_ch3 (R1_DI_ch3.2 R11_DI_ch3.2), DI_ch4 (R1_DI_ch4.2 R11_DI_ch4.2), suply_1w (C15.2 L3.2 R22.2), U_485_1 (8 pins), U_PROC (11 pins), PWM_OUT (R32.1 R35.1), indication (C36.1 U2.10 U2.16), U_heat (DA8_U_heat#1.1)
3v_2: DI_ch1 (R2_DI_ch1.2 R12_DI_ch1.2), DI_ch2 (R2_DI_ch2.2 R12_DI_ch2.2), DI_ch3 (R2_DI_ch3.2 R12_DI_ch3.2), DI_ch4 (R2_DI_ch4.2 R12_DI_ch4.2), suply_1w (C19.2 L4.2), U_485_2 (8 pins), U_PROC (10 pins), indication (C37.1 U3.10 U3.16), U_heat (DA8_U_heat#2.1)
24+: suply_1w (C16.1 C17.1 VD8.K), PWM_OUT (6 pins)
24-: DI_ch1 (R4_DI_ch1.1 R9_DI_ch1.1 R14_DI_ch1.1 R19_DI_ch1.1), DI_ch2 (R4_DI_ch2.1 R9_DI_ch2.1 R14_DI_ch2.1 R19_DI_ch2.1), DI_ch3 (R4_DI_ch3.1 R9_DI_ch3.1 R14_DI_ch3.1 R19_DI_ch3.1), DI_ch4 (R4_DI_ch4.1 R9_DI_ch4.1 R14_DI_ch4.1 R19_DI_ch4.1), suply_1w (7 pins), PWM_OUT (6 pins)
ERTH: U_485_1 (C50_U_485_1.1 R41_U_485_1.1 VD24_U_485_1.A VD25_U_485_1.A), U_485_2 (C50_U_485_2.1 R41_U_485_2.1 VD24_U_485_2.A VD25_U_485_2.A)
GND: Main (VT1.4), DI_ch1 (C2_DI_ch1.1 C4_DI_ch1.1 C7_DI_ch1.1 C8_DI_ch1.1), DI_ch2 (C2_DI_ch2.1 C4_DI_ch2.1 C7_DI_ch2.1 C8_DI_ch2.1), DI_ch3 (C2_DI_ch3.1 C4_DI_ch3.1 C7_DI_ch3.1 C8_DI_ch3.1), DI_ch4 (C2_DI_ch4.1 C4_DI_ch4.1 C7_DI_ch4.1 C8_DI_ch4.1), suply_1w (8 pins), U_485_1 (14 pins), U_PROC (27 pins), U_485_2 (14 pins), U_PROC (28 pins), indication (22 pins)
in24+: Main (X6.1 X6.2), suply_1w (FU1.1), U_heat (DA8_U_heat#1.4 Q4_U_heat#1.2), U_heat (DA8_U_heat#2.4 Q4_U_heat#2.2)
in24-: Main (X6.3 X6.4), suply_1w (VD7.K), U_heat (Q5_U_heat#1.3 R46_U_heat#1.1 R47_U_heat#1.1), U_heat (Q5_U_heat#2.3 R46_U_heat#2.1 R47_U_heat#2.1)
Pg: suply_1w (C21.2 R22.1 R25.1), U_PROC (DD1_U_PROC#1.15), U_PROC (DD1_U_PROC#2.15)
1out1_1: DI_ch1 (C4_DI_ch1.2 R1_DI_ch1.1 R5_DI_ch1.1), U_PROC (DD1_U_PROC#1.46)
1out1_2: DI_ch2 (C4_DI_ch2.2 R1_DI_ch2.1 R5_DI_ch2.1), U_PROC (DD1_U_PROC#1.43)
1out1_3: DI_ch3 (C4_DI_ch3.2 R1_DI_ch3.1 R5_DI_ch3.1), U_PROC (DD1_U_PROC#1.41)
1out1_4: DI_ch4 (C4_DI_ch4.2 R1_DI_ch4.1 R5_DI_ch4.1), U_PROC (DD1_U_PROC#1.20)
1out2_1: DI_ch1 (C2_DI_ch1.2 R2_DI_ch1.1 R7_DI_ch1.1), U_PROC (DD1_U_PROC#1.45)
1out2_2: DI_ch2 (C2_DI_ch2.2 R2_DI_ch2.1 R7_DI_ch2.1), U_PROC (DD1_U_PROC#1.42)
1out2_3: DI_ch3 (C2_DI_ch3.2 R2_DI_ch3.1 R7_DI_ch3.1), U_PROC (DD1_U_PROC#1.25)
1out2_4: DI_ch4 (C2_DI_ch4.2 R2_DI_ch4.1 R7_DI_ch4.1), U_PROC (DD1_U_PROC#1.19)
2out1_1: DI_ch1 (C8_DI_ch1.2 R11_DI_ch1.1 R15_DI_ch1.1), U_PROC (DD1_U_PROC#2.46)
2out1_2: DI_ch2 (C8_DI_ch2.2 R11_DI_ch2.1 R15_DI_ch2.1), U_PROC (DD1_U_PROC#2.43)
2out1_3: DI_ch3 (C8_DI_ch3.2 R11_DI_ch3.1 R15_DI_ch3.1), U_PROC (DD1_U_PROC#2.41)
2out1_4: DI_ch4 (C8_DI_ch4.2 R11_DI_ch4.1 R15_DI_ch4.1), U_PROC (DD1_U_PROC#2.20)
2out2_1: DI_ch1 (C7_DI_ch1.2 R12_DI_ch1.1 R17_DI_ch1.1), U_PROC (DD1_U_PROC#2.45)
2out2_2: DI_ch2 (C7_DI_ch2.2 R12_DI_ch2.1 R17_DI_ch2.1), U_PROC (DD1_U_PROC#2.42)
2out2_3: DI_ch3 (C7_DI_ch3.2 R12_DI_ch3.1 R17_DI_ch3.1), U_PROC (DD1_U_PROC#2.25)
2out2_4: DI_ch4 (C7_DI_ch4.2 R12_DI_ch4.1 R17_DI_ch4.1), U_PROC (DD1_U_PROC#2.19)
485_1_N: Main (X7.2 XP1.2), U_485_1 (D1_U_485_1.12 D1_U_485_1.13 VD23_U_485_1.K VD24_U_485_1.K)
485_1_P: Main (X7.1 XP1.1), U_485_1 (D1_U_485_1.11 D1_U_485_1.14 VD23_U_485_1.A VD25_U_485_1.K)
485_2_N: Main (X7.4 XP1.5), U_485_2 (D1_U_485_2.12 D1_U_485_2.13 VD23_U_485_2.K VD24_U_485_2.K)
485_2_P: Main (X7.3 XP1.4), U_485_2 (D1_U_485_2.11 D1_U_485_2.14 VD23_U_485_2.A VD25_U_485_2.K)
G1: Main (VT1.2), U_PROC (DD1_U_PROC#1.29)
G2: Main (VT1.5), U_PROC (DD1_U_PROC#2.29)
~{Hon}_1: U_PROC (DD1_U_PROC#1.14), U_heat (R44_U_heat#1.1)
in1_1: Main (X9.1), DI_ch1 (8 pins)
in1_2: Main (X9.3), DI_ch2 (8 pins)
in1_3: Main (X10.1), DI_ch3 (8 pins)
in1_4: Main (X10.3), DI_ch4 (8 pins)
in2_1: Main (X9.2), DI_ch1 (8 pins)
in2_2: Main (X9.4), DI_ch2 (8 pins)
in2_3: Main (X10.2), DI_ch3 (8 pins)
in2_4: Main (X10.4), DI_ch4 (8 pins)
NetC43_U_485_1_1: U_485_1 (C43_U_485_1.1), U_PROC (DD1_U_PROC#1.12)
NetC43_U_485_2_1: U_485_2 (C43_U_485_2.1), U_PROC (DD1_U_PROC#2.12)
NetDA6_2: U_PROC (DD1_U_PROC#1.22), PWM_OUT (DA6.2)
NetDA7_2: U_PROC (DD1_U_PROC#1.21), PWM_OUT (DA7.2)
NetDD1_U_PROC#1_26: U_PROC (DD1_U_PROC#1.26), indication (U2.11)
NetDD1_U_PROC#1_27: U_PROC (DD1_U_PROC#1.27), indication (U2.12)
NetDD1_U_PROC#1_28: U_PROC (DD1_U_PROC#1.28), indication (U2.14)
NetDD1_U_PROC#1_39: U_PROC (DD1_U_PROC#1.39), U_PROC (DD1_U_PROC#2.40)
NetDD1_U_PROC#1_40: U_PROC (DD1_U_PROC#1.40), U_PROC (DD1_U_PROC#2.39)
NetDD1_U_PROC#2_14: U_PROC (DD1_U_PROC#2.14), U_heat (R44_U_heat#2.1)
NetFU2_2: Main (X8.1 X8.2), PWM_OUT (FU2.2)
NetFU3_2: Main (X8.3 X8.4), PWM_OUT (FU3.2)
OE: Main (VT1.6), DI_ch1 (DA1_DI_ch1.5 DA1_DI_ch1.7 DA2_DI_ch1.5 DA2_DI_ch1.7), DI_ch2 (DA1_DI_ch2.5 DA1_DI_ch2.7 DA2_DI_ch2.5 DA2_DI_ch2.7), DI_ch3 (DA1_DI_ch3.5 DA1_DI_ch3.7 DA2_DI_ch3.5 DA2_DI_ch3.7), DI_ch4 (DA1_DI_ch4.5 DA1_DI_ch4.7 DA2_DI_ch4.5 DA2_DI_ch4.7)
RX_485: U_485_1 (C42_U_485_1.1 DD2_U_485_1.1 DD2_U_485_1.2), U_PROC (DD1_U_PROC#1.11)
RX_485: U_485_2 (C42_U_485_2.1 DD2_U_485_2.1 DD2_U_485_2.2), U_PROC (DD1_U_PROC#2.11)
SPI2.MOSI: U_PROC (DD1_U_PROC#2.28), indication (U3.14)
SPI2.SCK: U_PROC (DD1_U_PROC#2.26), indication (U3.11)
SPI2.STCP: U_PROC (DD1_U_PROC#2.27), indication (U3.12)
TX_485: U_485_1 (C44_U_485_1.1 DD3_U_485_1.1 DD3_U_485_1.2), U_PROC (DD1_U_PROC#1.10)
TX_485: U_485_2 (C44_U_485_2.1 DD3_U_485_2.1 DD3_U_485_2.2), U_PROC (DD1_U_PROC#2.10)